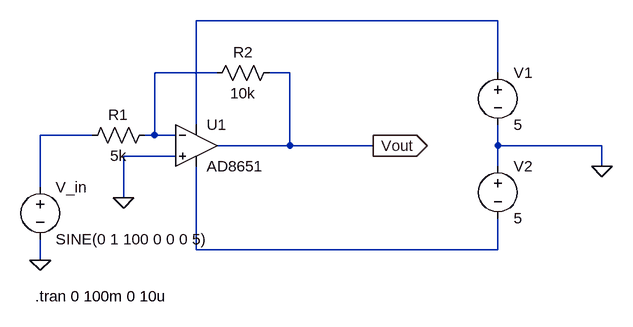
[diagram p0: schematic Draft1.asc]
Draft1.asc, the LTspice schematic file:
Version 4
SHEET 1 900 680
WIRE 720 -144 256 -144
WIRE 288 -64 192 -64
WIRE 400 -64 368 -64
WIRE 720 -64 720 -144
WIRE 256 16 256 -144
WIRE 96 32 16 32
WIRE 192 32 192 -64
WIRE 192 32 176 32
WIRE 224 32 192 32
WIRE 400 48 400 -64
WIRE 400 48 288 48
WIRE 528 48 400 48
WIRE 720 48 720 16
WIRE 880 48 720 48
WIRE 224 64 144 64
WIRE 720 80 720 48
WIRE 880 80 880 48
WIRE 16 112 16 32
WIRE 144 128 144 64
WIRE 256 208 256 80
WIRE 720 208 720 160
WIRE 720 208 256 208
WIRE 16 224 16 192
FLAG 16 224 0
FLAG 144 128 0
FLAG 880 80 0
FLAG 528 48 Vout
IOPIN 528 48 Out
SYMBOL voltage 16 96 R0
WINDOW 123 24 124 Left 2
WINDOW 39 24 124 Left 2
SYMATTR InstName V_in
SYMATTR Value SINE(0 1 100 0 0 0 5)
SYMBOL res 192 16 R90
WINDOW 0 0 56 VBottom 2
WINDOW 3 32 56 VTop 2
SYMATTR InstName R1
SYMATTR Value 5k
SYMBOL res 384 -80 R90
WINDOW 0 0 56 VBottom 2
WINDOW 3 32 56 VTop 2
SYMATTR InstName R2
SYMATTR Value 10k
SYMBOL OpAmps\\AD8651 256 -16 R0
SYMATTR InstName U1
SYMBOL voltage 720 -80 R0
SYMATTR InstName V1
SYMATTR Value 5
SYMBOL voltage 720 64 R0
SYMATTR InstName V2
SYMATTR Value 5
TEXT 8 280 Left 2 !.tran 0 100m 0 10u

The netlist it stands for:
* Draft1.asc
V_in N003 0 SINE(0 1 100 0 0 0 5)
R1 N002 N003 5k
R2 Vout N002 10k
XU1 0 N002 N001 N004 Vout AD8651  ; pins In+ In- V+ V- OUT
V1 N001 0 5
V2 0 N004 5
.tran 0 100m 0 10u
.backanno
.end